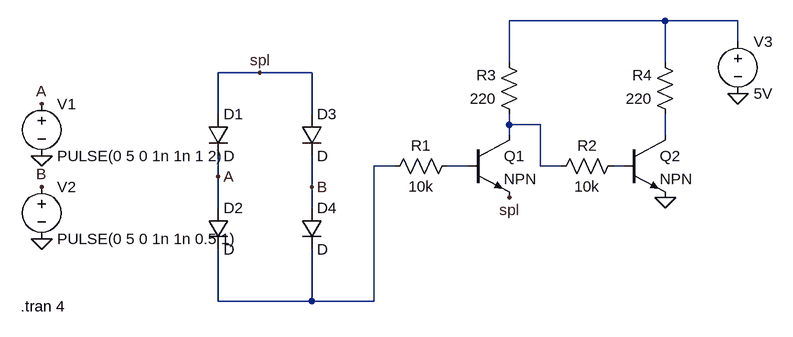
[diagram p0: schematic XOR_Diode.asc]
XOR_Diode.asc, the LTspice schematic file:
Version 4
SHEET 1 888 680
WIRE 720 -48 480 -48
WIRE 832 -48 720 -48
WIRE 832 -16 832 -48
WIRE 480 16 480 -48
WIRE 720 16 720 -48
WIRE 96 32 32 32
WIRE 176 32 96 32
WIRE 32 96 32 32
WIRE 176 96 176 32
WIRE 480 112 480 96
WIRE 528 112 480 112
WIRE 480 128 480 112
WIRE 720 128 720 96
WIRE 304 176 272 176
WIRE 416 176 384 176
WIRE 528 176 528 112
WIRE 560 176 528 176
WIRE 656 176 640 176
WIRE 32 192 32 160
WIRE 176 208 176 160
WIRE 32 240 32 192
WIRE 176 240 176 208
WIRE 32 384 32 304
WIRE 176 384 176 304
WIRE 176 384 32 384
WIRE 272 384 272 176
WIRE 272 384 176 384
FLAG -240 160 0
FLAG -240 288 0
FLAG 720 224 0
FLAG 480 224 spl
FLAG 96 32 spl
FLAG -240 80 A
FLAG 32 192 A
FLAG -240 208 B
FLAG 176 208 B
FLAG 832 64 0
SYMBOL diode 16 96 R0
SYMATTR InstName D1
SYMBOL diode 16 240 R0
SYMATTR InstName D2
SYMBOL diode 160 96 R0
SYMATTR InstName D3
SYMBOL diode 160 240 R0
SYMATTR InstName D4
SYMBOL voltage -240 64 R0
SYMATTR InstName V1
SYMATTR Value PULSE(0 5 0 1n 1n 1 2)
SYMBOL voltage -240 192 R0
SYMATTR InstName V2
SYMATTR Value PULSE(0 5 0 1n 1n 0.5 1)
SYMBOL voltage 832 -32 R0
SYMATTR InstName V3
SYMATTR Value 5V
SYMBOL npn 416 128 R0
SYMATTR InstName Q1
SYMBOL npn 656 128 R0
SYMATTR InstName Q2
SYMBOL res 400 160 R90
WINDOW 0 0 56 VBottom 2
WINDOW 3 32 56 VTop 2
SYMATTR InstName R1
SYMATTR Value 10k
SYMBOL res 656 160 R90
WINDOW 0 0 56 VBottom 2
WINDOW 3 32 56 VTop 2
SYMATTR InstName R2
SYMATTR Value 10k
SYMBOL res 496 112 R180
WINDOW 0 36 76 Left 2
WINDOW 3 36 40 Left 2
SYMATTR InstName R3
SYMATTR Value 220
SYMBOL res 736 112 R180
WINDOW 0 36 76 Left 2
WINDOW 3 36 40 Left 2
SYMATTR InstName R4
SYMATTR Value 220
TEXT -272 392 Left 2 !.tran 4

The netlist it stands for:
* XOR_Diode.asc
D1 spl A D
D2 A N004 D
D3 spl B D
D4 B N004 D
V1 A 0 PULSE(0 5 0 1n 1n 1 2)
V2 B 0 PULSE(0 5 0 1n 1n 0.5 1)
V3 N001 0 5V
Q1 N002 N005 spl 0 NPN
Q2 N003 N006 0 0 NPN
R1 N005 N004 10k
R2 N006 N002 10k
R3 N002 N001 220
R4 N003 N001 220
.model D D
.lib standard.dio
.model NPN NPN
.model PNP PNP
.lib standard.bjt
.tran 4
.backanno
.end